# Altium project xe2banhfix.PrjPcb
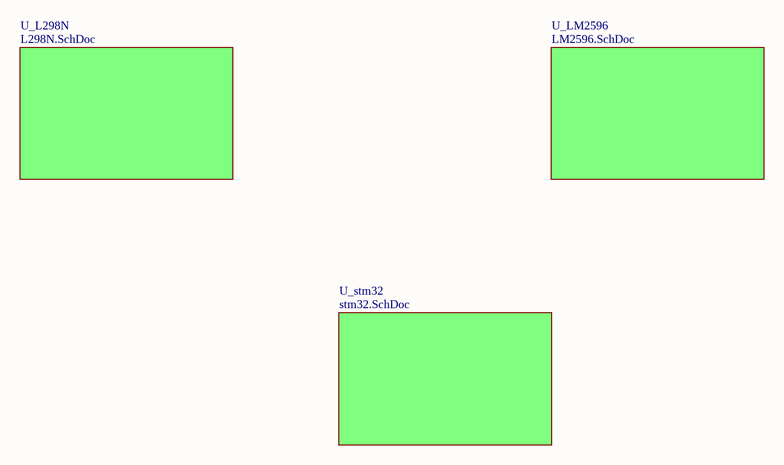
[diagram p0: main.SchDoc]
4 sheets, 32 parts. Net scope: global (net labels, ports and power ports of the same name join across sheets).
Board file: main1.PcbDoc
Sheets:
  main.SchDoc
    U_L298N = L298N.SchDoc
    U_LM2596 = LM2596.SchDoc
    U_stm32 = stm32.SchDoc

## Sheet main.SchDoc
size A4; SheetNumber: 1; SheetTotal: 4

### Sub-sheets
U_L298N = L298N.SchDoc: no entries
U_LM2596 = LM2596.SchDoc: no entries
U_stm32 = stm32.SchDoc: no entries

## Sheet L298N.SchDoc
size A4; SheetNumber: 3; SheetTotal: 4
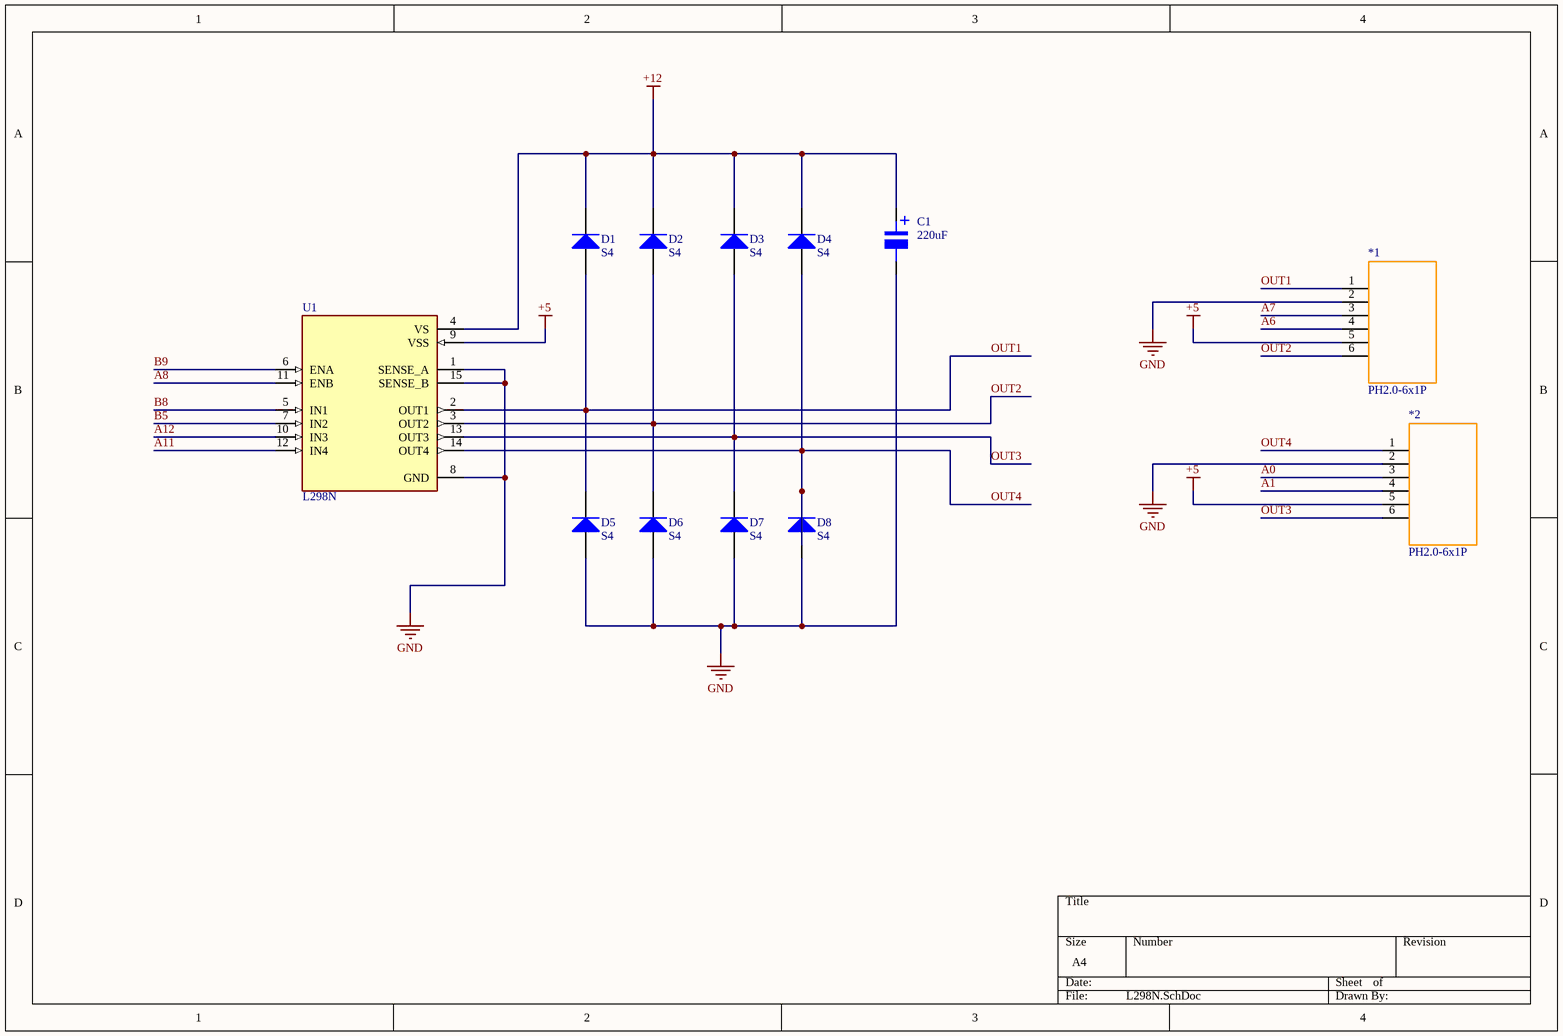
[diagram p1: L298N.SchDoc]

### Parts
*1  PH2.0-6x1P  [PH2.0-6P]
*2  PH2.0-6x1P  [PH2.0-6P]
C1  220uF  [tu nhom 8 (f)]
D1  S4  [DIODE SOD-123]
D2  S4  [DIODE SOD-123]
D3  S4  [DIODE SOD-123]
D4  S4  [DIODE SOD-123]
D5  S4  [DIODE SOD-123]
D6  S4  [DIODE SOD-123]
D7  S4  [DIODE SOD-123]
D8  S4  [DIODE SOD-123]
U1  L298N  [L298N]

### Nets
+5: *1.5 *2.5 U1.9(VSS)
+12: C1.1 D1.2(K) D2.2(K) D3.2(K) D4.2(K) U1.4(VS)
GND: *1.2 *2.2 C1.2 D5.1(A) D6.1(A) D7.1(A) D8.1(A) U1.1(SENSE_A) U1.8(GND) U1.15(SENSE_B)
A0: *2.3
A1: *2.4
A6: *1.4
A7: *1.3
A8: U1.11(ENB)
A11: U1.12(IN4)
A12: U1.10(IN3)
B5: U1.7(IN2)
B8: U1.5(IN1)
B9: U1.6(ENA)
OUT1: *1.1 D1.1(A) D5.2(K) U1.2(OUT1)
OUT2: *1.6 D2.1(A) D6.2(K) U1.3(OUT2)
OUT3: *2.6 D3.1(A) D7.2(K) U1.13(OUT3)
OUT4: *2.1 D4.1(A) D8.2(K) U1.14(OUT4)

### Notes on the sheet
- (in symbol Tu Nhom 220uF 25V) +

### Library data of the parts
C1 = Tu Nhom 220uF 25V: Dán; Don_Vi: Con; So_Chan: 2; Ten_Linh_Kien: Tụ Nhôm 220uF 25V; Ma_Hang: MH002221; Chung_Loai: Dán; Kieu_Chan: *
D1-D8 = Diode S4: Dán; Ten_Linh_Kien: Diode S4 SOD123 ( 1N5819 SOD123); Ma_Hang: MH005519; Don_Vi: Con; Ghi_Chu: *; Chung_Loai: Dán; Kieu_Chan: *
U1 = L298N: Half Bridge _4_ Driver DC Motors, Relays, Solenoids, Stepper Motors Bipolar 15-Multiwatt; MF: STMicroelectronics; MP: L298N; Package: Multiwatt-15 STMicroelectronics; Price: None; Availability: Unavailable; Value: *; SnapEDA_Link: https://www.snapeda.com/parts/L298N/STMicroelectronics/view-part/294022/?ref=snap

## Sheet LM2596.SchDoc
size A4; SheetNumber: 2; SheetTotal: 4
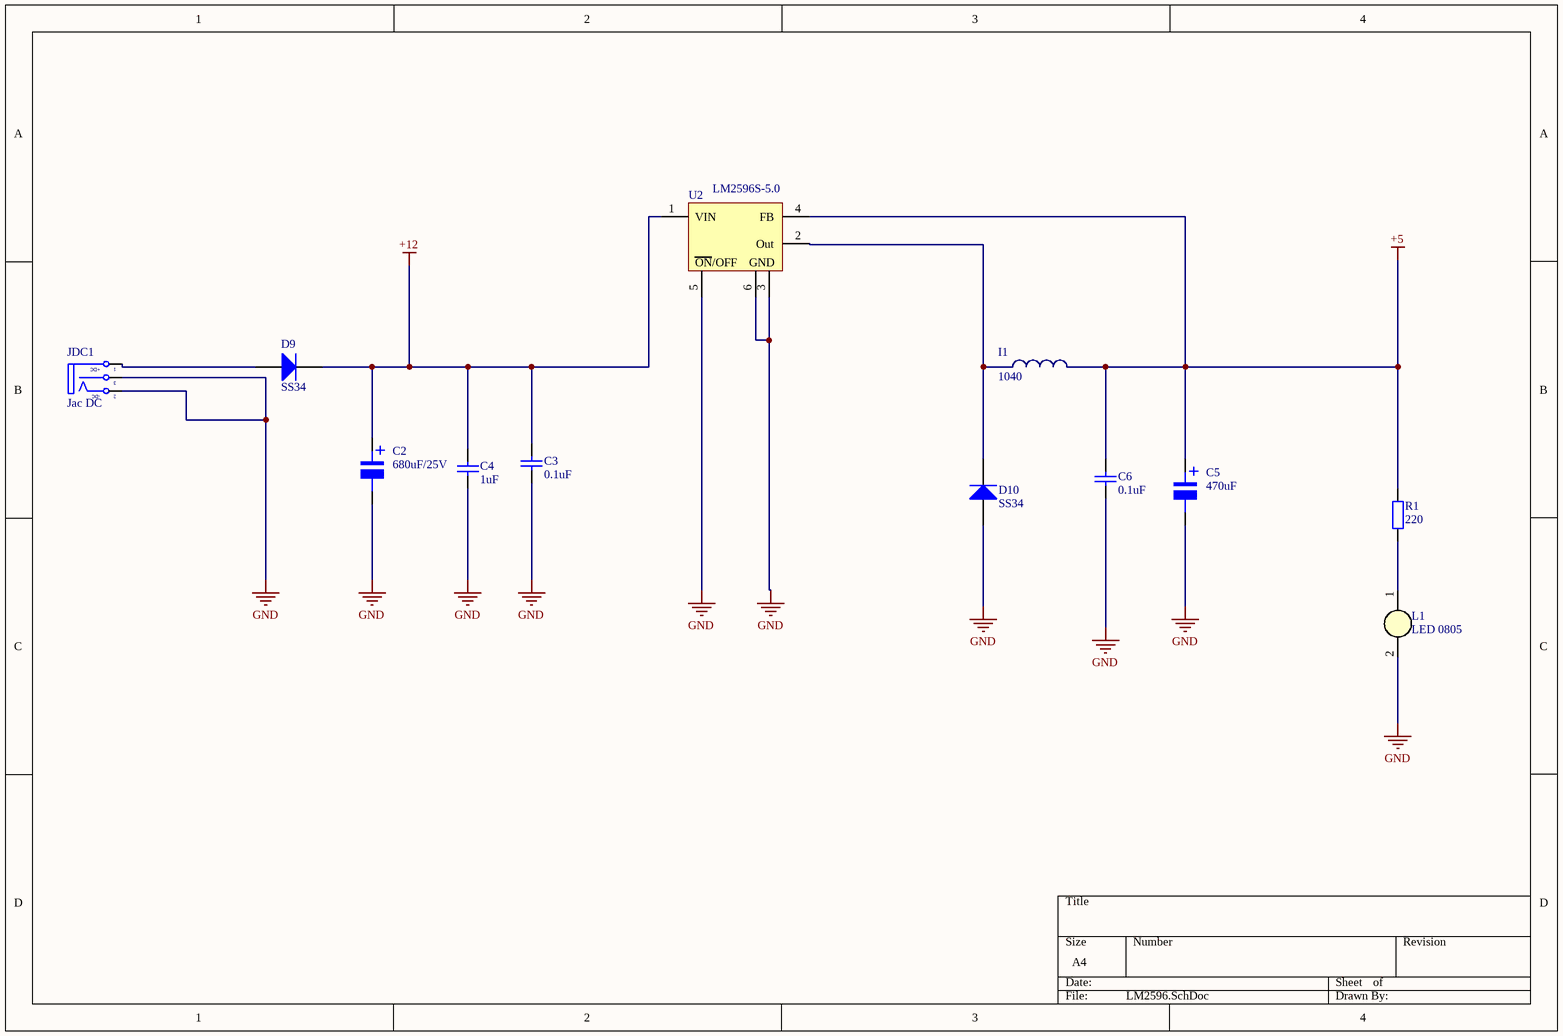
[diagram p2: LM2596.SchDoc]

### Parts
C2  680uF/25V  [tu nhom 10 (G)]
C3  0.1uF  [tu 0603]
C4  1uF  [tu 0603]
C5  470uF  [tu nhom 10 (G)]
C6  0.1uF  [tu 0603]
D9  SS34  [DIODE SMA]
D10  SS34  [DIODE SMA]
I1  1040  [1040]
JDC1  Jac DC  [DC0]
L1  LED 0805  [LED-0805-Yellow]
R1  220  [tro smd 0805]
U2  LM2596S-5.0  [TO-263-5]

### Nets
+5: C5.1 C6.1 I1.2 R1.2 U2.4(FB)
+12: C2.1 C3.1 C4.1 D9.2(K) U2.1(VIN)
GND: C2.2 C3.2 C4.2 C5.2 C6.2 D10.1(A) JDC1.2(TN) JDC1.3(S) L1.2(K) U2.3(GND) U2.5(~{ON}/OFF) U2.6(PAD)
NetD9_1: D9.1(A) JDC1.1(T)
NetD10_2: D10.2(K) I1.1 U2.2(Out)
NetL1_1: L1.1(A) R1.1

### Notes on the sheet
- (in symbol DCIN) +DC; -DC
- (in symbol LM2596S-5.0) ON/OFF
- (in symbol Tu Nhom 470uF 35V) +
- (in symbol Tu Nhom 680uF 16V) +

### Library data of the parts
C2 = Tu Nhom 680uF 16V: Dán; Don_Vi: Con; So_Chan: 2; Ten_Linh_Kien: Tụ Nhôm 680uF 16V 10x10.5MM; Ma_Hang: MH007513; Chung_Loai: Dán; Kieu_Chan: *
C3 C6 = Tu 0603 104 50V 10%: Dán; Don_Vi: Con; So_Chan: 2; Ten_Linh_Kien: Tụ 0603 104-100nF 10% 50V; Ma_Hang: MH004568; Chung_Loai: Dán; Kieu_Chan: *
C4 = Tu 0603 105 50V 10%: Dán; Don_Vi: Con; So_Chan: 2; Ten_Linh_Kien: Tụ 0603 105-1uF 50V 10%; Ma_Hang: MH004569; Chung_Loai: Dán; Kieu_Chan: *
C5 = Tu Nhom 470uF 35V: Dán; Don_Vi: Con; So_Chan: 2; Ten_Linh_Kien: Tụ Nhôm 470uF 35V 10x10.5MM; Ma_Hang: MH004418; Chung_Loai: Dán; Kieu_Chan: *
D9 D10 = Diode SS34 ( 1N5822 ): Dán; Don_Vi: Con; Ma_Hang: MH002104; Ten_Linh_Kien: Diode SS34 3A 40V SMA ( 1N5822 SS34A); Kieu_Chan: *; Chung_Loai: Dán
I1 = 1040: Generic Encapsulated Inductor 1040.
JDC1 = DCIN: Jac DC input; Value: Jac DC
L1 = LED 0805 Trang: Dán; Don_Vi: Con; Ma_Hang: MH002946; Ten_Linh_Kien: LED 0805 Màu Trắng ( White); Ghi_Chu: *; Kieu_Chan: *; Chung_Loai: Dán
R1 = Tro 0805 1% 1k: Dán; Don_Vi: Con; So_Chan: 2; Ten_Linh_Kien: Trở 0805 1% 1k; Ma_Hang: MH005468; Chung_Loai: Dán; Kieu_Chan: *
U2 = LM2596S-5.0: Simple Switcher 3A Step-Down Voltage Regulator

## Sheet stm32.SchDoc
size A4; SheetNumber: 4; SheetTotal: 4
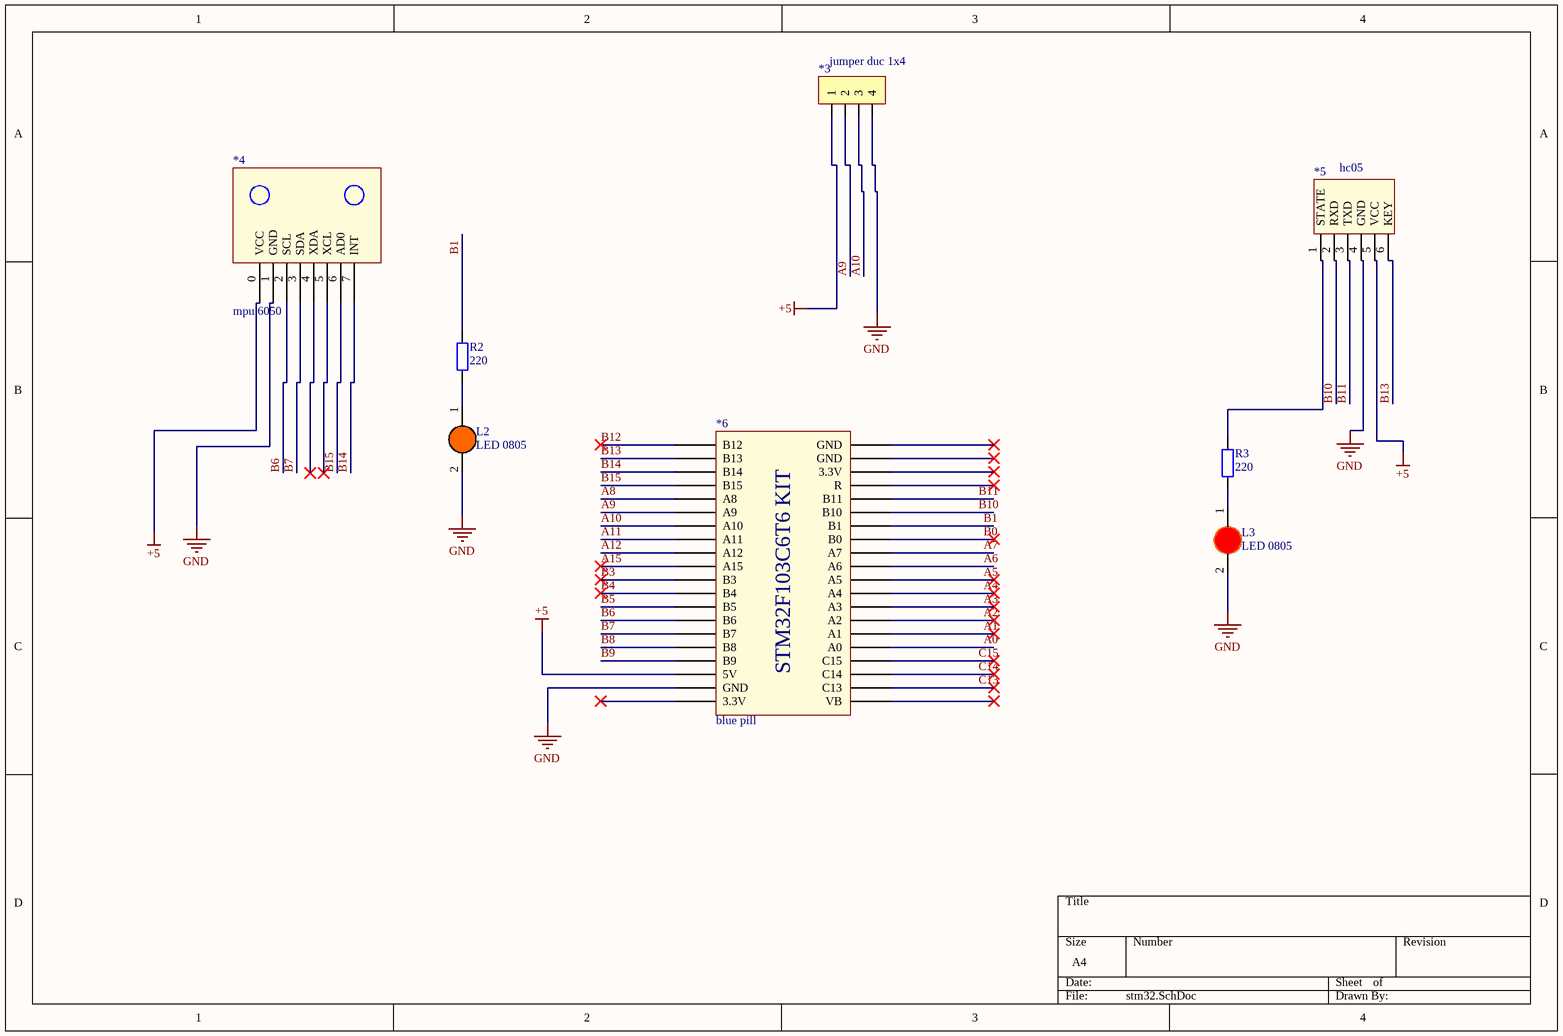
[diagram p3: stm32.SchDoc]

### Parts
*3  jumper duc 1x4  [jumper cai 1x4]
*4  mpu 6050  [MPU 6050]
*5  hc05  [HC05]
*6  blue pill  [blue pill]
L2  LED 0805  [LED-0805-Orange]
L3  LED 0805  [LED-0805-Red]
R2  220  [tro smd 0805]
R3  220  [tro smd 0805]

### Nets
+5: *3.1 *4.0(VCC) *5.5(VCC) *6.18(5V)
GND: *3.4 *4.1(GND) *5.4(GND) *6.19(GND) L2.2(K) L3.2(K)
A0: *6.25(A0)
A1: *6.26(A1)
A2: *6.27(A2)
A3: *6.28(A3)
A4: *6.29(A4)
A5: *6.30(A5)
A6: *6.31(A6)
A7: *6.32(A7)
A8: *6.5(A8)
A9: *3.2 *6.6(A9)
A10: *3.3 *6.7(A10)
A11: *6.8(A11)
A12: *6.9(A12)
A15: *6.10(A15)
B0: *6.33(B0)
B1: *6.34(B1) R2.2
B3: *6.11(B3)
B4: *6.12(B4)
B5: *6.13(B5)
B6: *4.2(SCL) *6.14(B6)
B7: *4.3(SDA) *6.15(B7)
B8: *6.16(B8)
B9: *6.17(B9)
B10: *5.2(RXD) *6.35(B10)
B11: *5.3(TXD) *6.36(B11)
B12: *6.1(B12)
B13: *5.6(KEY) *6.2(B13)
B14: *4.7(INT) *6.3(B14)
B15: *4.6(AD0) *6.4(B15)
C13: *6.22(C13)
C14: *6.23(C14)
C15: *6.24(C15)
Net*5_1: *5.1(STATE) R3.2
NetL2_1: L2.1(A) R2.1
NetL3_1: L3.1(A) R3.1

Not connected (* = marked no-connect by the designer): *4 4(XDA)* 5(XCL)*; *6 20(3.3V)* 21(VB)* 37(R)* 38(3.3V)* 39(GND)* 40(GND)*

### Notes on the sheet
- (in symbol blue pill) STM32F103C6T6 KIT

### Library data of the parts
L2 = LED 0805 Cam: Dán; Don_Vi: Con; Ma_Hang: MH002328; Ten_Linh_Kien: LED 0805 Màu Cam ( Orange); Ghi_Chu: *; Kieu_Chan: *; Chung_Loai: Dán
L3 = LED 0805 Do: Dán; Don_Vi: Con; Ma_Hang: MH000897; Ten_Linh_Kien: LED 0805 Màu Đỏ (Red); Ghi_Chu: *; Kieu_Chan: *; Chung_Loai: Dán
R2 R3 = Tro 0805 1% 1k: as R1 on sheet LM2596; Chung_Loai: Dán; Kieu_Chan: *

## Nets that join several sheets
+5: L298N (*1.5 *2.5 U1.9), LM2596 (5 pins), stm32 (*3.1 *4.0 *5.5 *6.18)
+12: L298N (6 pins), LM2596 (5 pins)
GND: L298N (10 pins), LM2596 (12 pins), stm32 (6 pins)
A0: L298N (*2.3), stm32 (*6.25)
A1: L298N (*2.4), stm32 (*6.26)
A6: L298N (*1.4), stm32 (*6.31)
A7: L298N (*1.3), stm32 (*6.32)
A8: L298N (U1.11), stm32 (*6.5)
A11: L298N (U1.12), stm32 (*6.8)
A12: L298N (U1.10), stm32 (*6.9)
B5: L298N (U1.7), stm32 (*6.13)
B8: L298N (U1.5), stm32 (*6.16)
B9: L298N (U1.6), stm32 (*6.17)